# Altium schematic sheet Autonoom.SchDoc
size A3; SheetNumber: 5; SheetTotal: 6
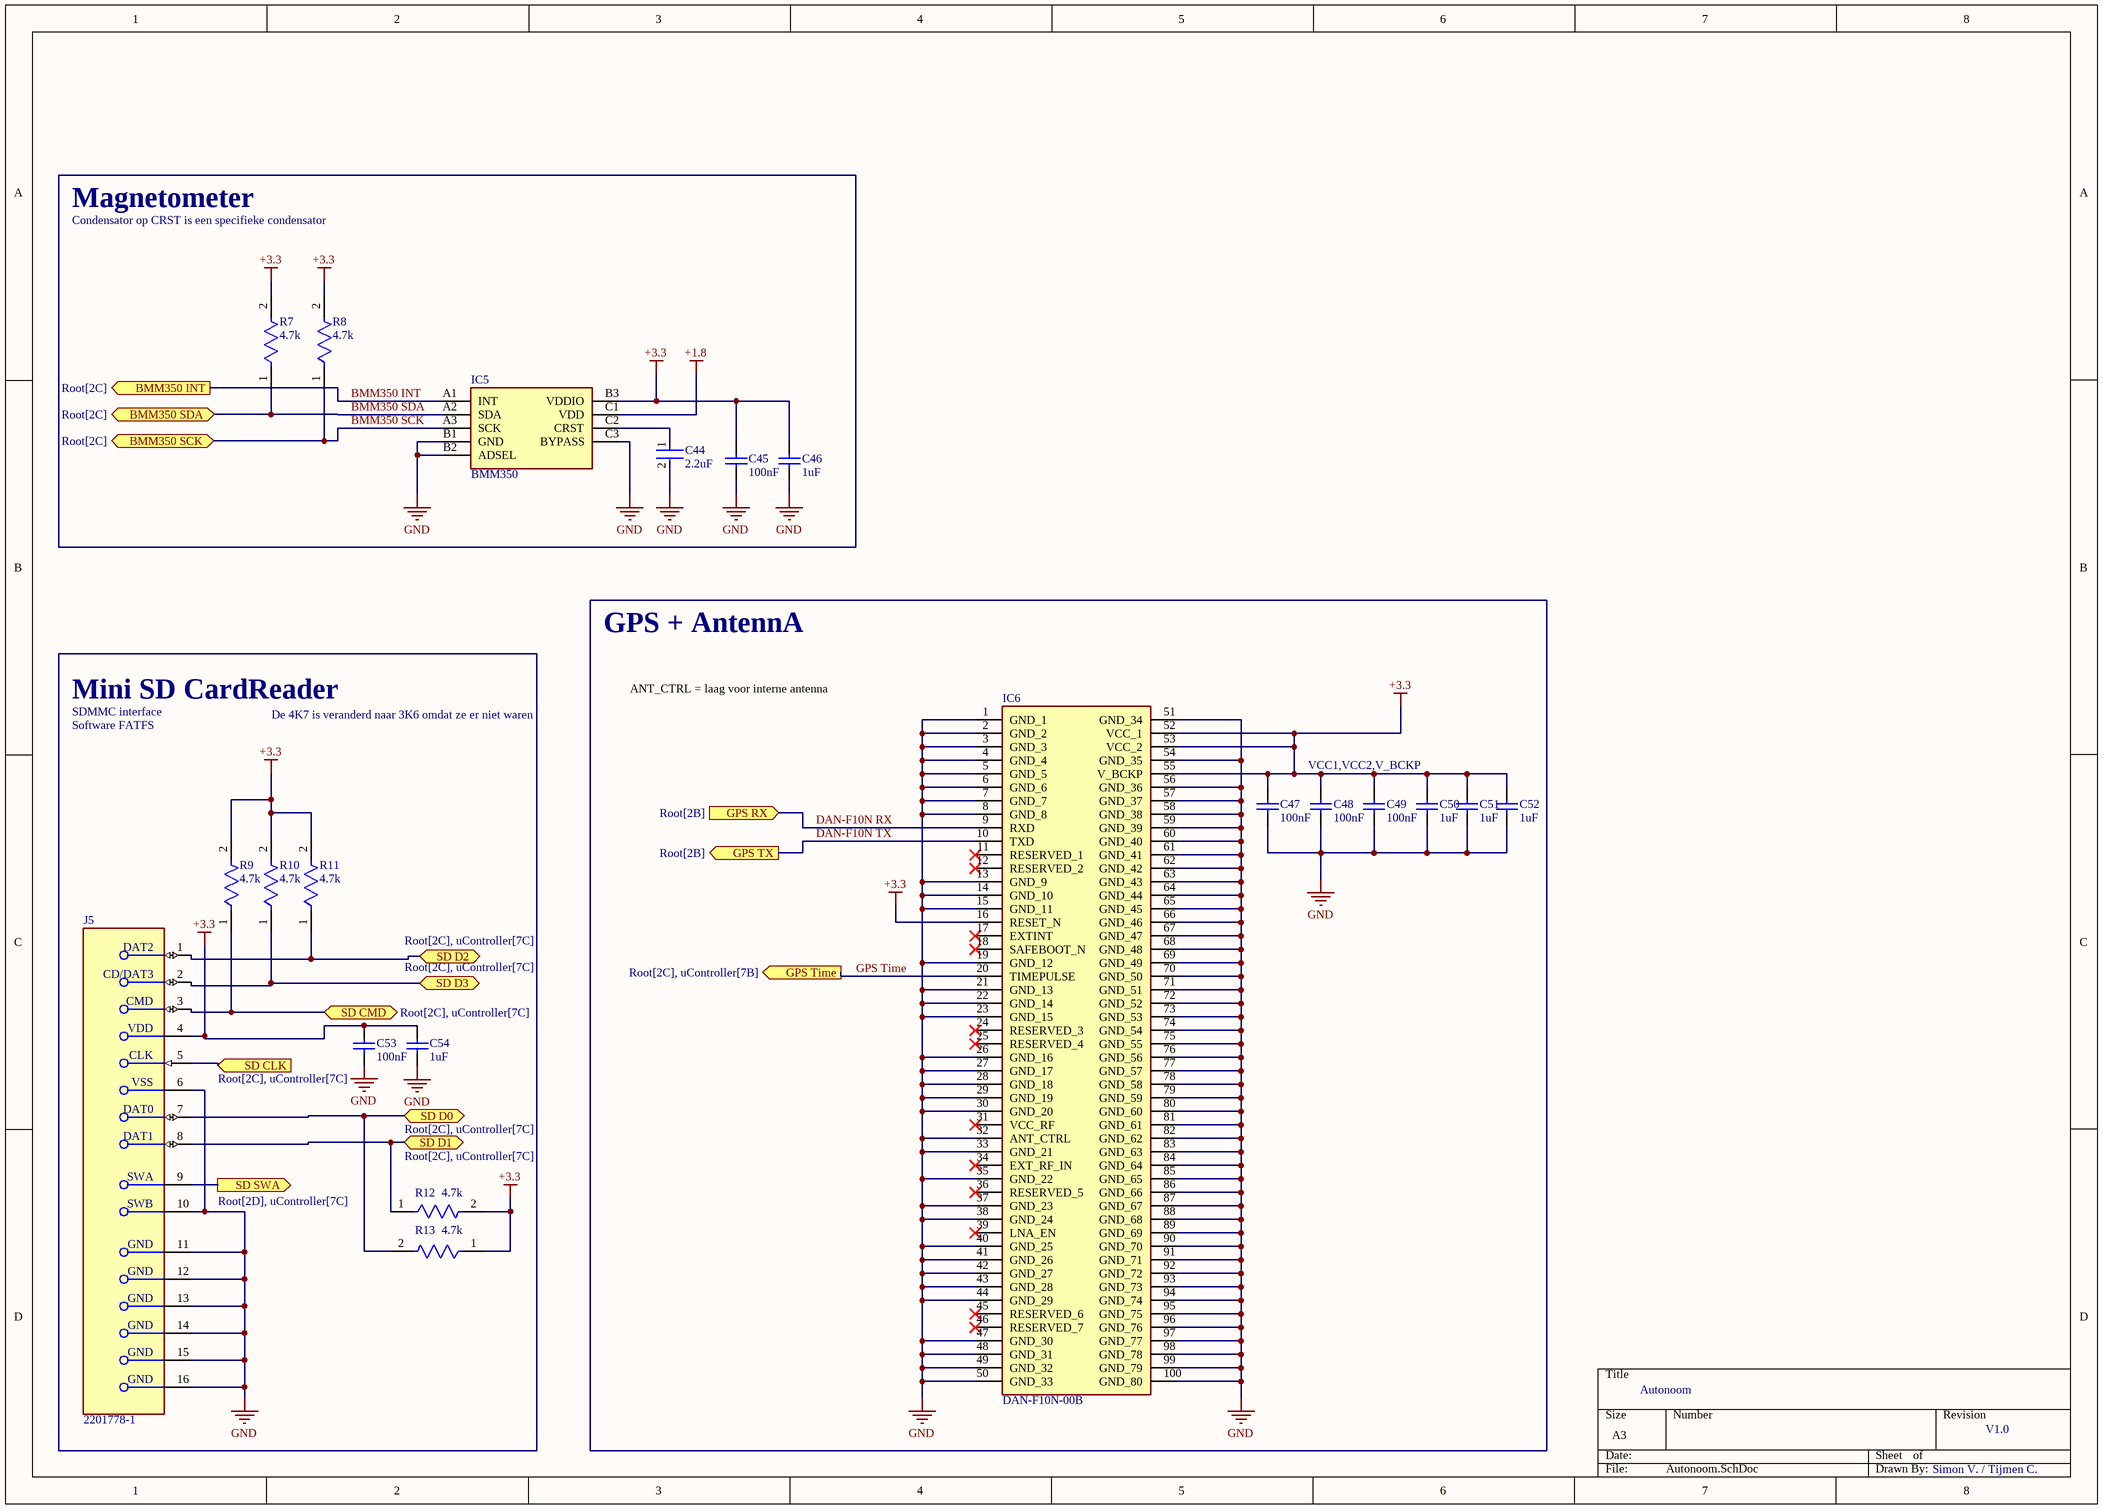
[diagram p0: Autonoom.SchDoc]

## Parts
C44  2.2uF  [FP-CGB4B-MFG]
C45  100nF  [CAPC1608X92X38ML15T08]
C46  1uF  [CAPC1608X90X35NL15T15]
C47  100nF  [CAPC1608X92X38ML15T08]
C48  100nF  [CAPC1608X92X38ML15T08]
C49  100nF  [CAPC1608X92X38ML15T08]
C50  1uF  [CAPC1608X90X35NL15T15]
C51  1uF  [CAPC1608X90X35NL15T15]
C52  1uF  [CAPC1608X90X35NL15T15]
C53  100nF  [CAPC1608X92X38ML15T08]
C54  1uF  [CAPC1608X90X35NL15T15]
IC5  BMM350  [BGA9C40P3X3_128X128X54]
IC6  DAN-F10N-00B  [DANF10N00B]
J5  2201778-1  [FP-2201778-1-MFG]
R7  4.7k  [FP-AC0603-IPC_A]
R8  4.7k  [FP-AC0603-IPC_A]
R9  4.7k  [FP-AC0603-IPC_A]
R10  4.7k  [FP-AC0603-IPC_A]
R11  4.7k  [FP-AC0603-IPC_A]
R12  4.7k  [FP-AC0603-IPC_A]
R13  4.7k  [FP-AC0603-IPC_A]

## Ports
BMM350 INT (out, see Root[2C]), BMM350 SCK (bidir, see Root[2C]), BMM350 SDA (bidir, see Root[2C]), GPS RX (in, see Root[2B]), GPS Time (out, see Root[2C], uController[7B]), GPS TX (out, see Root[2B]), SD CLK (in, see Root[2C], uController[7C]), SD CMD (bidir, see Root[2C], uController[7C]), SD D0 (bidir, see Root[2C], uController[7C]), SD D1 (bidir, see Root[2C], uController[7C]), SD D2 (bidir, see Root[2C], uController[7C]), SD D3 (bidir, see Root[2C], uController[7C]), SD SWA (out, see Root[2D], uController[7C])

## Nets
+1.8: IC5.C1(VDD)
+3.3: C45.2 C46.2 C47.2 C48.2 C49.2 C50.2 C51.2 C52.2 C53.2 C54.2 IC5.B3(VDDIO) IC6.16(RESET_N) IC6.52(VCC_1) IC6.53(VCC_2) IC6.55(V_BCKP) J5.4(VDD) R7.2 R8.2 R9.2 R10.2 R11.2 R12.2 R13.1
GND: C44.2 C45.1 C46.1 C47.1 C48.1 C49.1 C50.1 C51.1 C52.1 C53.1 C54.1 IC5.B1(GND) IC5.B2(ADSEL) IC5.C3(BYPASS) IC6.1(GND_1) IC6.2(GND_2) IC6.3(GND_3) IC6.4(GND_4) IC6.5(GND_5) IC6.6(GND_6) IC6.7(GND_7) IC6.8(GND_8) IC6.13(GND_9) IC6.14(GND_10) IC6.15(GND_11) IC6.19(GND_12) IC6.21(GND_13) IC6.22(GND_14) IC6.23(GND_15) IC6.26(GND_16) IC6.27(GND_17) IC6.28(GND_18) IC6.29(GND_19) IC6.30(GND_20) IC6.32(ANT_CTRL) IC6.33(GND_21) IC6.35(GND_22) IC6.37(GND_23) IC6.38(GND_24) IC6.40(GND_25) IC6.41(GND_26) IC6.42(GND_27) IC6.43(GND_28) IC6.44(GND_29) IC6.47(GND_30) IC6.48(GND_31) IC6.49(GND_32) IC6.50(GND_33) IC6.51(GND_34) IC6.54(GND_35) IC6.56(GND_36) IC6.57(GND_37) IC6.58(GND_38) IC6.59(GND_39) IC6.60(GND_40) IC6.61(GND_41) IC6.62(GND_42) IC6.63(GND_43) IC6.64(GND_44) IC6.65(GND_45) IC6.66(GND_46) IC6.67(GND_47) IC6.68(GND_48) IC6.69(GND_49) IC6.70(GND_50) IC6.71(GND_51) IC6.72(GND_52) IC6.73(GND_53) IC6.74(GND_54) IC6.75(GND_55) IC6.76(GND_56) IC6.77(GND_57) IC6.78(GND_58) IC6.79(GND_59) IC6.80(GND_60) IC6.81(GND_61) IC6.82(GND_62) IC6.83(GND_63) IC6.84(GND_64) IC6.85(GND_65) IC6.86(GND_66) IC6.87(GND_67) IC6.88(GND_68) IC6.89(GND_69) IC6.90(GND_70) IC6.91(GND_71) IC6.92(GND_72) IC6.93(GND_73) IC6.94(GND_74) IC6.95(GND_75) IC6.96(GND_76) IC6.97(GND_77) IC6.98(GND_78) IC6.99(GND_79) IC6.100(GND_80) J5.6(VSS) J5.10(SWB) J5.11(GND) J5.12(GND) J5.13(GND) J5.14(GND) J5.15(GND) J5.16(GND)
BMM350 INT: IC5.A1(INT) ; port BMM350 INT
BMM350 SCK: IC5.A3(SCK) R8.1 ; port BMM350 SCK
BMM350 SDA: IC5.A2(SDA) R7.1 ; port BMM350 SDA
DAN-F10N RX: IC6.9(RXD) ; port GPS RX
DAN-F10N TX: IC6.10(TXD) ; port GPS TX
GPS Time: IC6.20(TIMEPULSE) ; port GPS Time
SD CLK: J5.5(CLK) ; port SD CLK
SD CMD: J5.3(CMD) R9.1 ; port SD CMD
SD D0: J5.7(DAT0) R13.2 ; port SD D0
SD D1: J5.8(DAT1) R12.1 ; port SD D1
SD D2: J5.1(DAT2) R11.1 ; port SD D2
SD D3: J5.2(CD/DAT3) R10.1 ; port SD D3
SD SWA: J5.9(SWA) ; port SD SWA
NetC44_1: C44.1 IC5.C2(CRST)

Not connected (* = marked no-connect by the designer): IC6 11(RESERVED_1)* 12(RESERVED_2)* 17(EXTINT)* 18(SAFEBOOT_N)* 24(RESERVED_3)* 25(RESERVED_4)* 31(VCC_RF)* 34(EXT_RF_IN)* 36(RESERVED_5)* 39(LNA_EN)* 45(RESERVED_6)* 46(RESERVED_7)*

## Notes on the sheet
- Condensator op CRST is een specifieke condensator
- Magnetometer
- GPS + AntennA
- SDMMC interface
- Mini SD CardReader
- De 4K7 is veranderd naar 3K6 omdat ze er niet waren
- ANT_CTRL = laag voor interne antenna
- Software FATFS
- VCC1,VCC2,V_BCKP
- Autonoom
- V1.0
- Simon V. / Tijmen C.

## Library data of the parts
C44 = CMP-08246-003816-1: Multilayer Ceramic Capacitors 2.2uF ±10% 6.3V X7R SMD 0805, type: CGB4B3X7R0J225K055AB; Series: CGB; RoHS Compliant: Yes; Mount: Surface Mount; Package Quantity: 4000; Case Code (Metric): 2012; Width: 0.049inch; Max Operating Temperature: 125°C; Tolerance: 10%; Min Operating Temperature: -55°C; Case Code (Imperial): 0805; Capacitance: 2.2uF; Packaging: Tape and Reel; Voltage Rating: 6.3V; Length: 0.079inch; Thickness: 0.022inch; Case/Package: 0805
C45 C47-C49 C53 = CMP-2006-01140-1: Part Number: VJ0603Y104MXXAC; Manufacturer: Vitramon
C46 C50-C52 C54 = CMP-2006-04534-1: Part Number: 0603YD105MAT2A; Manufacturer: AVX Interconnect / Elco
IC5 = BMM350: Integrated Circuit; Manufacturer_Name: BOSCH; Datasheet Link: https://www.bosch-sensortec.com/media/boschsensortec/downloads/datasheets/bst-bmm350-ds001.pdf; Height: 0.54mm; Manufacturer_Part_Number: BMM350; Mouser Part Number: 262-BMM350; Mouser Price/Stock: https://www.mouser.co.uk/ProductDetail/Bosch-Sensortec/BMM350?qs=amGC7iS6iy9v98dnmxozLQ%3D%3D; Arrow Part Number: BMM350; Arrow Price/Stock: https://www.arrow.com/en/products/bmm350/bosch-sensortec?utm_currency=USD&region=nac
IC6 = DAN-F10N-00B: Integrated Circuit; Manufacturer_Name: u-blox; Datasheet Link: https://content.u-blox.com/sites/default/files/documents/DAN-F10N_DataSheet_UBXDOC-963802114-13074.pdf; Height: 12.4mm; Manufacturer_Part_Number: DAN-F10N-00B
J5 = CMP-03356-000002-1: MICRO SD PUSH PUSH LOW PROFILE T; Manufacturer: TE Connectivity; Pitch: 1.1mm; Is Female: yes; Current Rating: 0.5A; Conn Orientation: Right Angle; Memory Type: SDRAM; Number Of Contacts: 8; Voltage Rating: 10V; Height: 1.75mm; Package: 0; Temperature Range Low: -30°C; Octopart: https://octopart.com/2201778-1-te+connectivity-46448999; Temperature Range High: +85°C; Manufacturer Part Number: 2201778-1; Category: Conn; Temperature: -30°C to +85°C; Device Class L1: Connectors; Device Class L2: Memory Connectors; Automotive: No; ComponentLink2Description: Datasheet; Mouser Description: CONNECTOR, MICROSD, PUSH PUSH - REEL; Connector Type: Micro SD; Contact Material:; Lead Free: Yes; Contact Material: Gold,Nickel; Digikey Description: MICRO SD PUSH PUSH LOW PROFILE T; ComponentLink2URL: https://www.te.com/commerce/DocumentDelivery/DDEController?Action=showdoc&DocId=Specification+Or+Standard%7F108-78951%7FA%7Fpdf%7FEnglish%7FENG_SS_108-78951_A.pdf%7F2201778-1; RoHS: TRUE; Footprint Url: https://www.te.com/commerce/DocumentDelivery/DDEController?Action=showdoc&DocId=Customer+Drawing%7F2201778%7FC%7Fpdf%7FEnglish%7FENG_CD_2201778_C.pdf%7F2201778-1; Device Class L3: unset
R7-R13 = CMP-03412-006483-2: RES 4.7KΩ 1.00% 0.1W 0603; Tolerance: 1%; Resistance: 4.7kR; Case/Package: 0603; RoHS Compliant: Yes